# Altium schematic sheet PressureSensorCircuit.SchDoc
size A
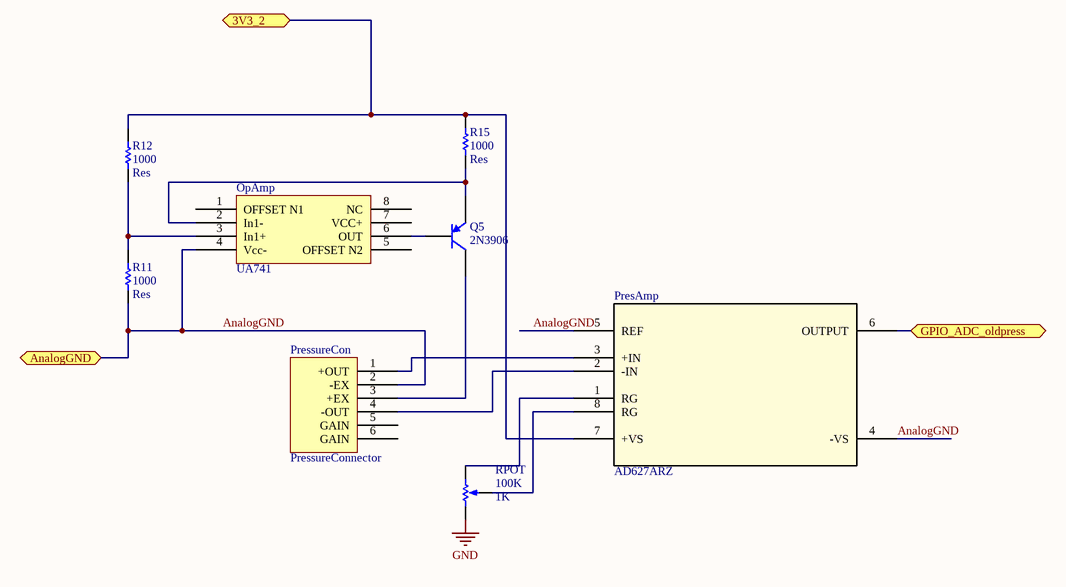
[diagram p0: PressureSensorCircuit.SchDoc]

## Parts
OpAmp  UA741  [UA741]
PresAmp  AD627ARZ  [R_8]
PressureCon  PressureConnector  [Pressure Connector]
Q5  2N3906  [TO-92A]
R11  1000  value Res  [AXIAL-0.3]
R12  1000  value Res  [AXIAL-0.3]
R15  1000  value Res  [AXIAL-0.3]
RPOT  100K  value 1K  [VR5]

## Ports
3V3_2 (bidir), AnalogGND (bidir), GPIO_ADC_oldpress (bidir)

## Nets
GND: RPOT.1(TOP)
3V3_2: PresAmp.7(+VS) R12.1 R15.1 ; port 3V3_2
AnalogGND: OpAmp.4(Vcc-) PresAmp.4(-VS) PresAmp.5(REF) PressureCon.2(-EX) R11.2 ; port AnalogGND
GPIO_ADC_oldpress: PresAmp.6(OUTPUT) ; port GPIO_ADC_oldpress
NetOpAmp_2: OpAmp.2(In1-) Q5.1(E) R15.2
NetOpAmp_3: OpAmp.3(In1+) R11.1 R12.2
NetOpAmp_6: OpAmp.6(OUT) Q5.2(B)
NetPresAmp_1: PresAmp.1(RG) RPOT.2(BOT)
NetPresAmp_2: PresAmp.2(-IN) PressureCon.4(-OUT)
NetPresAmp_3: PresAmp.3(+IN) PressureCon.1(+OUT)
NetPresAmp_8: PresAmp.8(RG) RPOT.3(TAP)
NetPressureCon_3: PressureCon.3(+EX) Q5.3(C)

Not connected (* = marked no-connect by the designer): OpAmp 1(OFFSET_N1) 5(OFFSET_N2) 7(VCC+) 8(NC); PressureCon 5(GAIN) 6(GAIN)

## Library data of the parts
PresAmp = AD627ARZ: Imported; Manufacturer_Part_Number: AD627ARZ; Vendor: Vendor; RefDes: Refdes; Type: Type; Value: Value
PressureCon = PressureConnector: Molex 53261-0671
Q5 = 2N3906: PNP General Purpose Amplifier; Published: 8-Jun-2000; LatestRevisionDate: 15-Jan-2003; LatestRevisionNote: PCB Footprint 'BCY-W3/D4.7' replaced; DatasheetVersion: 1997; PackageVersion: Sep-1998; PackageReference: TO-92A; Publisher: Altium Limited; PackageDescription: TO, Flat Index; 3 In-Line, Axial Leads; Body Dia. 4.5mm; Leads 0.51 x 0.48 mm (max); ComponentLink1Description: Manufacturer Link; ComponentLink1URL: http://www.fairchildsemi.com/; ComponentLink2Description: Datasheet; ComponentLink2URL: http://www.fairchildsemi.com/ds/2N%2F2N3906.pdf
R11 R12 R15 = Res1: Resistor- 696-1552-ND; Published: 8-Jun-2000; LatestRevisionDate: 17-Jul-2002; LatestRevisionNote: Re-released for DXP Platform.; PackageReference: AXIAL-0.3; Publisher: Altium Limited; PackageDescription: Axial Device, Thru-Hole; 2 Leads; 0.3 in Pin Spacing
RPOT = RPot: Potentiometer; Sim Note: Enter the Resistance value and the set point into parameter fields.; Set Position: 0.5; Published: 8-Jun-2000; LatestRevisionDate: 17-Jul-2002; LatestRevisionNote: Re-released for DXP Platform.; PackageReference: VR5; Publisher: Altium Limited; PackageDescription: Variable Resistor, Thru-Hole; 3 Leads